# Altium schematic sheet demo.SchDoc
size B
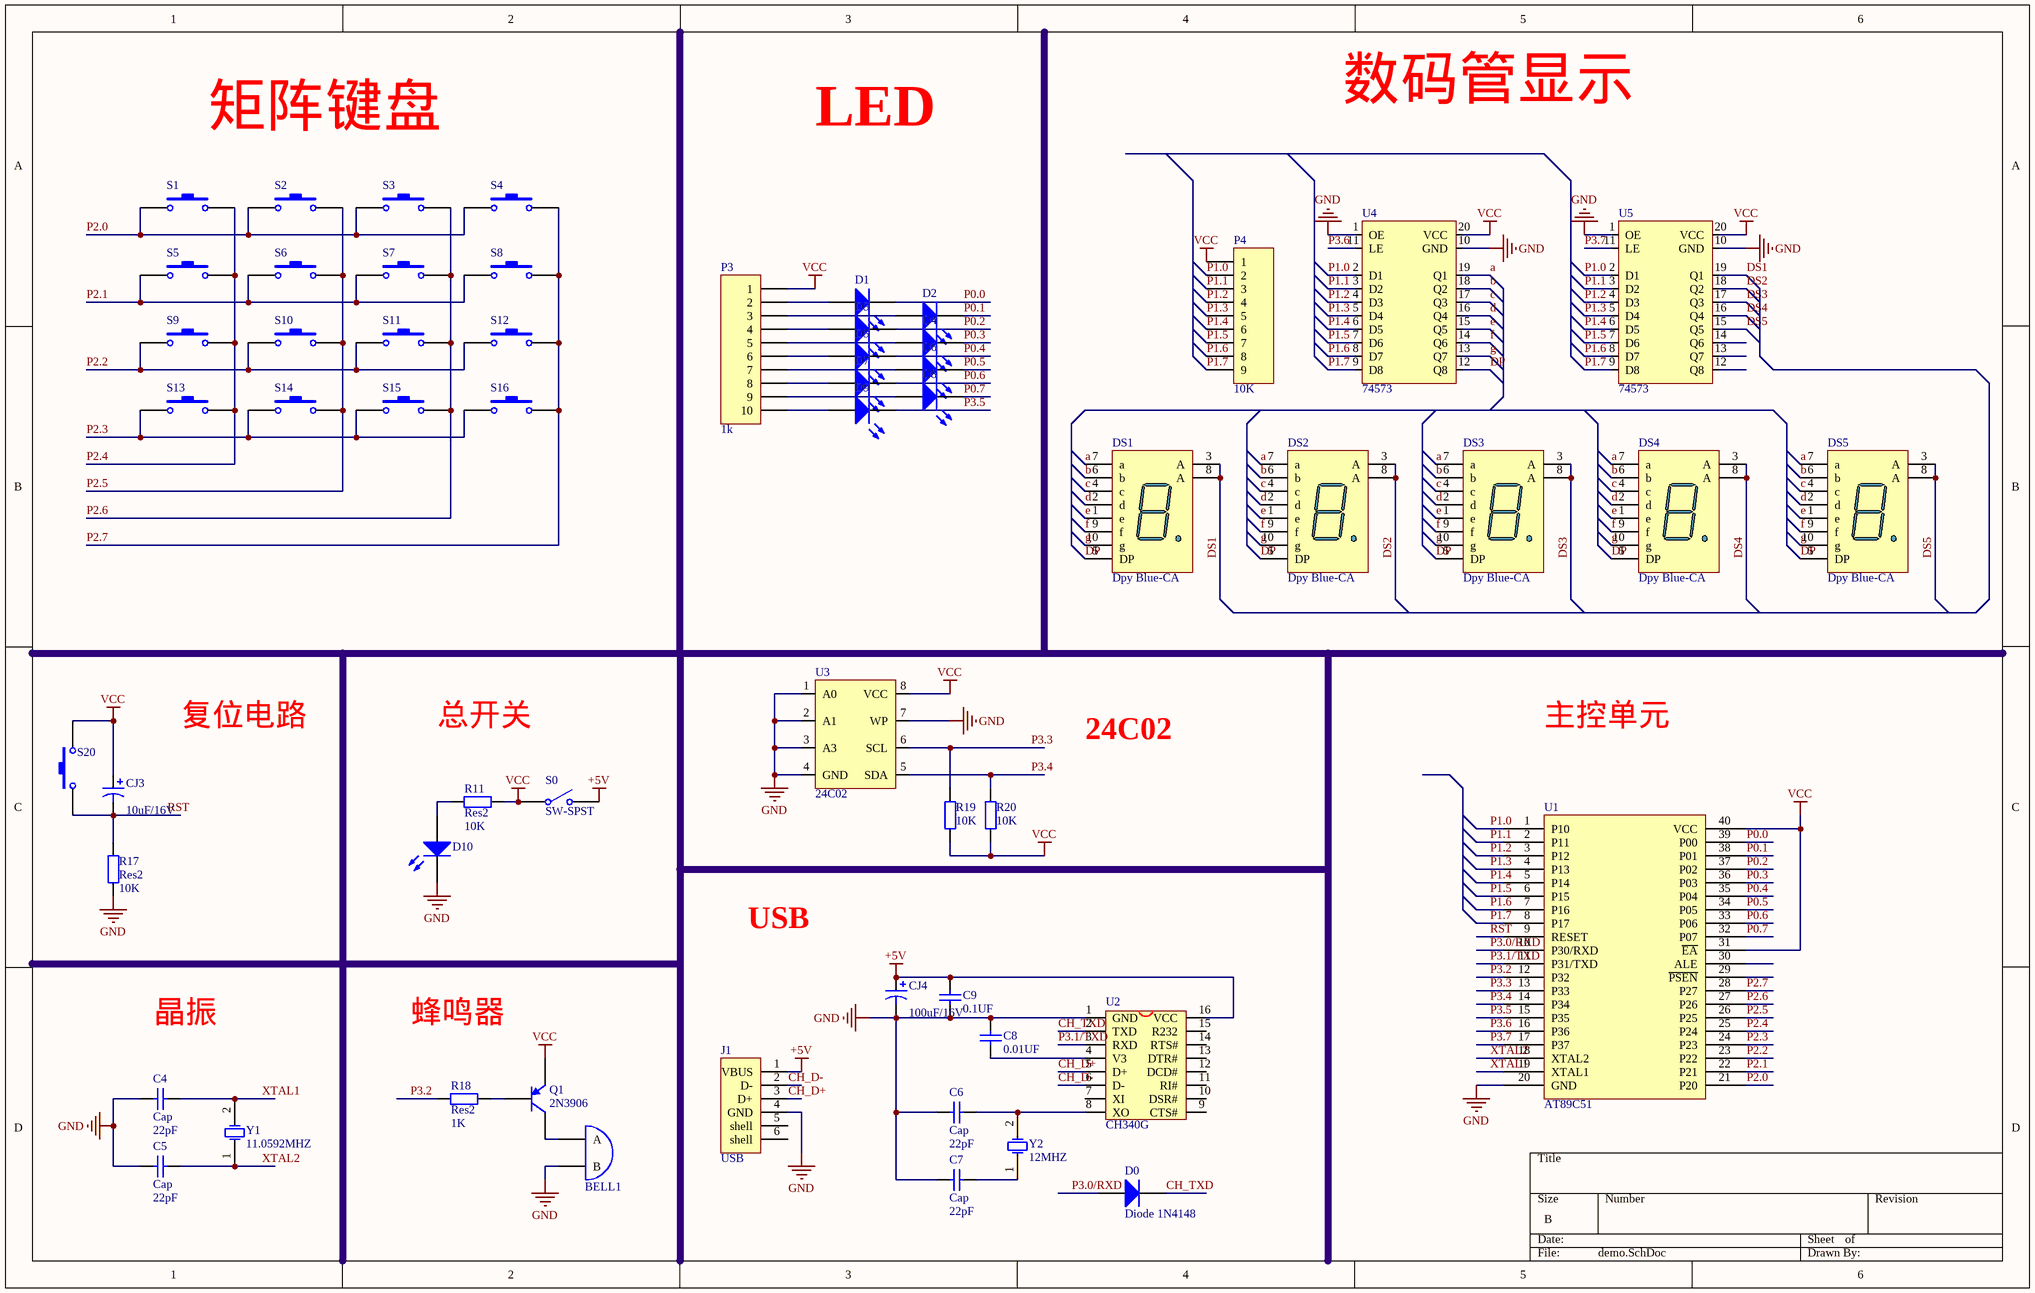
[diagram p0: demo.SchDoc]

## Parts
BELL1  BELL  [BELL]  (value not drawn)
C4  Cap  value 22pF  [0805C]
C5  Cap  value 22pF  [0805C]
C6  Cap  value 22pF  [0805C]
C7  Cap  value 22pF  [0805C]
C8  0.01UF  [0805C]
C9  0.1UF  [0805C]
CJ3  value 10uF/16V  [RB10U]
CJ4  value 100uF/16V  [RB10U]
D0  Diode 1N4148  [SOD123F]
D1  LED0  [0805-LED]  (value not drawn)
D2  LED0  [0805-LED]  (value not drawn)
D3  LED0  [0805-LED]  (value not drawn)
D4  LED0  [0805-LED]  (value not drawn)
D5  LED0  [0805-LED]  (value not drawn)
D6  LED0  [0805-LED]  (value not drawn)
D7  LED0  [0805-LED]  (value not drawn)
D8  LED0  [0805-LED]  (value not drawn)
D9  LED0  [0805-LED]  (value not drawn)
D10  LED0  [0805-LED]  (value not drawn)
DS1  Dpy Blue-CA  [H]
DS2  Dpy Blue-CA  [H]
DS3  Dpy Blue-CA  [H]
DS4  Dpy Blue-CA  [H]
DS5  Dpy Blue-CA  [H]
J1  USB  [USB-B]
P3  1k  [HDR1X10]
P4  10K  [HDR1X9]
Q1  2N3906  [TO-92A]
R11  Res2  value 10K  [0805]
R17  Res2  value 10K  [0805]
R18  Res2  value 1K  [0805]
R19  10K  [0805]
R20  10K  [0805]
S0  SW-SPST  [SWD]
S1  (no value)  [SWD]
S2  (no value)  [SWD]
S3  (no value)  [SWD]
S4  (no value)  [SWD]
S5  (no value)  [SWD]
S6  (no value)  [SWD]
S7  (no value)  [SWD]
S8  (no value)  [SWD]
S9  (no value)  [SWD]
S10  (no value)  [SWD]
S11  (no value)  [SWD]
S12  (no value)  [SWD]
S13  (no value)  [SWD]
S14  (no value)  [SWD]
S15  (no value)  [SWD]
S16  (no value)  [SWD]
S20  (no value)  [SWD]
U1  AT89C51  [DIP40紧锁座]
U2  CH340G  [SO-16]
U3  24C02  [SOP-8]
U4  74573  [SO20W]
U5  74573  [SO20W]
Y1  11.0592MHZ  [XTAL]
Y2  12MHZ  [XTAL]

## Nets
+5V: C9.2 CJ4.1 J1.1(VBUS) S0.2(NO) U2.16(VCC)
GND: BELL1.2(B) C4.1 C5.1 C6.1 C7.1 C8.2 C9.1 CJ4.2 D10.2(K) J1.4(GND) R17.1 U1.20(GND) U2.1(GND) U3.1(A0) U3.2(A1) U3.3(A3) U3.4(GND) U3.7(WP) U4.1(OE) U4.10(GND) U5.1(OE) U5.10(GND)
VCC: CJ3.1 P3.1 P4.1 Q1.1(E) R11.1 R19.2 R20.2 S0.1(COMMON) S20.2 U1.31(~{EA}) U1.40(VCC) U3.8(VCC) U4.20(VCC) U5.20(VCC)
a: DS1.7(a) DS2.7(a) DS3.7(a) DS4.7(a) DS5.7(a) U4.19(Q1)
b: DS1.6(b) DS2.6(b) DS3.6(b) DS4.6(b) DS5.6(b) U4.18(Q2)
c: DS1.4(c) DS2.4(c) DS3.4(c) DS4.4(c) DS5.4(c) U4.17(Q3)
CH_D+: J1.3(D+) U2.5(D+)
CH_D-: J1.2(D-) U2.6(D-)
CH_TXD: D0.2(K) U2.2(TXD)
d: DS1.2(d) DS2.2(d) DS3.2(d) DS4.2(d) DS5.2(d) U4.16(Q4)
DP: DS1.5(DP) DS2.5(DP) DS3.5(DP) DS4.5(DP) DS5.5(DP) U4.12(Q8)
DS1: DS1.3(A) DS1.8(A) U5.19(Q1)
DS2: DS2.3(A) DS2.8(A) U5.18(Q2)
DS3: DS3.3(A) DS3.8(A) U5.17(Q3)
DS4: DS4.3(A) DS4.8(A) U5.16(Q4)
DS5: DS5.3(A) DS5.8(A) U5.15(Q5)
e: DS1.1(e) DS2.1(e) DS3.1(e) DS4.1(e) DS5.1(e) U4.15(Q5)
f: DS1.9(f) DS2.9(f) DS3.9(f) DS4.9(f) DS5.9(f) U4.14(Q6)
g: DS1.10(g) DS2.10(g) DS3.10(g) DS4.10(g) DS5.10(g) U4.13(Q7)
P0.0: D1.2(K) U1.39(P00)
P0.1: D2.2(K) U1.38(P01)
P0.2: D3.2(K) U1.37(P02)
P0.3: D4.2(K) U1.36(P03)
P0.4: D5.2(K) U1.35(P04)
P0.5: D6.2(K) U1.34(P05)
P0.6: D7.2(K) U1.33(P06)
P0.7: D8.2(K) U1.32(P07)
P1.0: P4.2 U1.1(P10) U4.2(D1) U5.2(D1)
P1.1: P4.3 U1.2(P11) U4.3(D2) U5.3(D2)
P1.2: P4.4 U1.3(P12) U4.4(D3) U5.4(D3)
P1.3: P4.5 U1.4(P13) U4.5(D4) U5.5(D4)
P1.4: P4.6 U1.5(P14) U4.6(D5) U5.6(D5)
P1.5: P4.7 U1.6(P15) U4.7(D6) U5.7(D6)
P1.6: P4.8 U1.7(P16) U4.8(D7) U5.8(D7)
P1.7: P4.9 U1.8(P17) U4.9(D8) U5.9(D8)
P2.0: S1.1 S2.1 S3.1 S4.1 U1.21(P20)
P2.1: S5.1 S6.1 S7.1 S8.1 U1.22(P21)
P2.2: S9.1 S10.1 S11.1 S12.1 U1.23(P22)
P2.3: S13.1 S14.1 S15.1 S16.1 U1.24(P23)
P2.4: S1.2 S5.2 S9.2 S13.2 U1.25(P24)
P2.5: S2.2 S6.2 S10.2 S14.2 U1.26(P25)
P2.6: S3.2 S7.2 S11.2 S15.2 U1.27(P26)
P2.7: S4.2 S8.2 S12.2 S16.2 U1.28(P27)
P3.0/RXD: D0.1(A) U1.10(P30/RXD)
P3.1/TXD: U1.11(P31/TXD) U2.3(RXD)
P3.2: R18.2 U1.12(P32)
P3.3: R19.1 U1.13(P33) U3.6(SCL)
P3.4: R20.1 U1.14(P34) U3.5(SDA)
P3.5: D9.2(K) U1.15(P35)
P3.6: U1.16(P36) U4.11(LE)
P3.7: U1.17(P37) U5.11(LE)
RST: CJ3.2 R17.2 S20.1 U1.9(RESET)
XTAL1: C4.2 U1.19(XTAL1) Y1.2(OSC2)
XTAL2: C5.2 U1.18(XTAL2) Y1.1(OSC1)
NetBELL1_1: BELL1.1(A) Q1.3(C)
NetC6_2: C6.2 U2.8(XO) Y2.2(OSC2)
NetC7_2: C7.2 Y2.1(OSC1)
NetC8_1: C8.1 U2.4(V3)
NetD1_1: D1.1(A) P3.2
NetD2_1: D2.1(A) P3.3
NetD3_1: D3.1(A) P3.4
NetD4_1: D4.1(A) P3.5
NetD5_1: D5.1(A) P3.6
NetD6_1: D6.1(A) P3.7
NetD7_1: D7.1(A) P3.8
NetD8_1: D8.1(A) P3.9
NetD9_1: D9.1(A) P3.10
NetD10_1: D10.1(A) R11.2
NetQ1_2: Q1.2(B) R18.1

Not connected (* = marked no-connect by the designer): J1 5(shell) 6(shell); U1 29(~{PSEN}) 30(ALE); U2 7(XI) 9(CTS#) 10(DSR#) 11(RI#) 12(DCD#) 13(DTR#) 14(RTS#) 15(R232); U5 12(Q8) 13(Q7) 14(Q6)

## Notes on the sheet
- 矩阵键盘
- LED
- 数码管显示
- 复位电路
- 总开关
- 24C02
- 主控单元
- USB
- 晶振
- 蜂鸣器

## Library data of the parts
C4-C7 = Cap: Capacitor; Published: 8-Jun-2000; LatestRevisionDate: 17-Jul-2002; LatestRevisionNote: Re-released for DXP Platform.; PackageReference: RAD-0.3; Publisher: Altium Limited
C8 C9 = Cap: Capacitor; Value: 22pF; Published: 8-Jun-2000; LatestRevisionDate: 17-Jul-2002; LatestRevisionNote: Re-released for DXP Platform.; PackageReference: RAD-0.3; Publisher: Altium Limited
CJ3 CJ4 = Cap Pol1: Polarized Capacitor (Radial); Published: 8-Jun-2000; LatestRevisionDate: 17-Jul-2002; LatestRevisionNote: Re-released for DXP Platform.; PackageReference: RB7.6-15; Publisher: Altium Limited
D0 = Diode 1N4148: High Conductance Fast Diode; Published: 8-Jun-2000; LatestRevisionDate: 17-Jul-2002; LatestRevisionNote: Re-released for DXP Platform.; DatasheetVersion: 1997; PackageReference: DO-35; Publisher: Altium Limited; Code_JEDEC: DO-204-AH; ComponentLink1Description: Manufacturer Link; ComponentLink1URL: http://www.fairchildsemi.com/; ComponentLink2Description: Datasheet; ComponentLink2URL: http://www.fairchildsemi.com/ds/1N%2F1N4148.pdf
D1-D10 = LED0: Typical INFRARED GaAs LED; Published: 8-Jun-2000; LatestRevisionDate: 08-Jul-2005; LatestRevisionNote: Mech Layer 1 removed.; PackageReference: LED-0; Publisher: Altium Limited
DS1-DS5 = Dpy Blue-CA: 14.2 mm General Purpose Blue 7-Segment Display: CA, RH DP, Gray Surface; MinimumIntensity: 2020 ucd; Note: IF = 10 mA; Published: 8-Jun-2000; LatestRevisionDate: 17-Dec-2003; LatestRevisionNote: Schematic revised, PCB Footprint replaced.; DatasheetVersion: 24-Sep-2002; PackageVersion: 24-Sep-2002; PackageReference: H; Publisher: Altium Limited; PackageDescription: LED, 7-Segment Display, 14.2 mm, RHD; 10 Leads; Row Space 15.24 mm; Pitch 2.54 mm; Colour: Blue; ComponentLink1Description: Manufacturer Link; ComponentLink1URL: http://www.agilent.com/
P3 = Header 10: Header, 10-Pin; LatestRevisionDate: 17-Jul-2002; LatestRevisionNote: Re-released for DXP Platform.; Publisher: Altium Limited
P4 = Header 9: Header, 9-Pin; LatestRevisionDate: 17-Jul-2002; LatestRevisionNote: Re-released for DXP Platform.; Publisher: Altium Limited
Q1 = 2N3906: PNP General Purpose Amplifier; Published: 8-Jun-2000; LatestRevisionDate: 15-Jan-2003; LatestRevisionNote: PCB Footprint 'BCY-W3/D4.7' replaced; DatasheetVersion: 1997; PackageVersion: Sep-1998; PackageReference: TO-92A; Publisher: Altium Limited; PackageDescription: TO, Flat Index; 3 In-Line, Axial Leads; Body Dia. 4.5mm; Leads 0.51 x 0.48 mm (max); ComponentLink1Description: Manufacturer Link; ComponentLink1URL: http://www.fairchildsemi.com/; ComponentLink2Description: Datasheet; ComponentLink2URL: http://www.fairchildsemi.com/ds/2N%2F2N3906.pdf
R11 R17 R18 = Res2: Resistor; Published: 8-Jun-2000; LatestRevisionDate: 17-Jul-2002; LatestRevisionNote: Re-released for DXP Platform.; PackageReference: AXIAL-0.4; Publisher: Altium Limited
R19 R20 = Res2: Resistor; Value: 1K; Published: 8-Jun-2000; LatestRevisionDate: 17-Jul-2002; LatestRevisionNote: Re-released for DXP Platform.; PackageReference: AXIAL-0.4; Publisher: Altium Limited
S0 = SW-SPST: Single-Pole, Single-Throw Switch; Published: 24-Mar-1999; LatestRevisionDate: 17-Jul-2002; LatestRevisionNote: Re-released for DXP Platform.; PackageReference: SPST-2; Publisher: Altium Limited
S1-S16 S20 = SW-PB: Switch; Published: 24-Mar-1999; LatestRevisionDate: 17-Jul-2002; LatestRevisionNote: Re-released for DXP Platform.; PackageReference: SPST-2; Publisher: Altium Limited
U2 = CH340G: USB2UART
Y1 Y2 = XTAL: Crystal Oscillator; Published: 8-Jun-2000; LatestRevisionDate: 17-Jul-2002; LatestRevisionNote: Re-released for DXP Platform.; PackageReference: R38; Publisher: Altium Limited